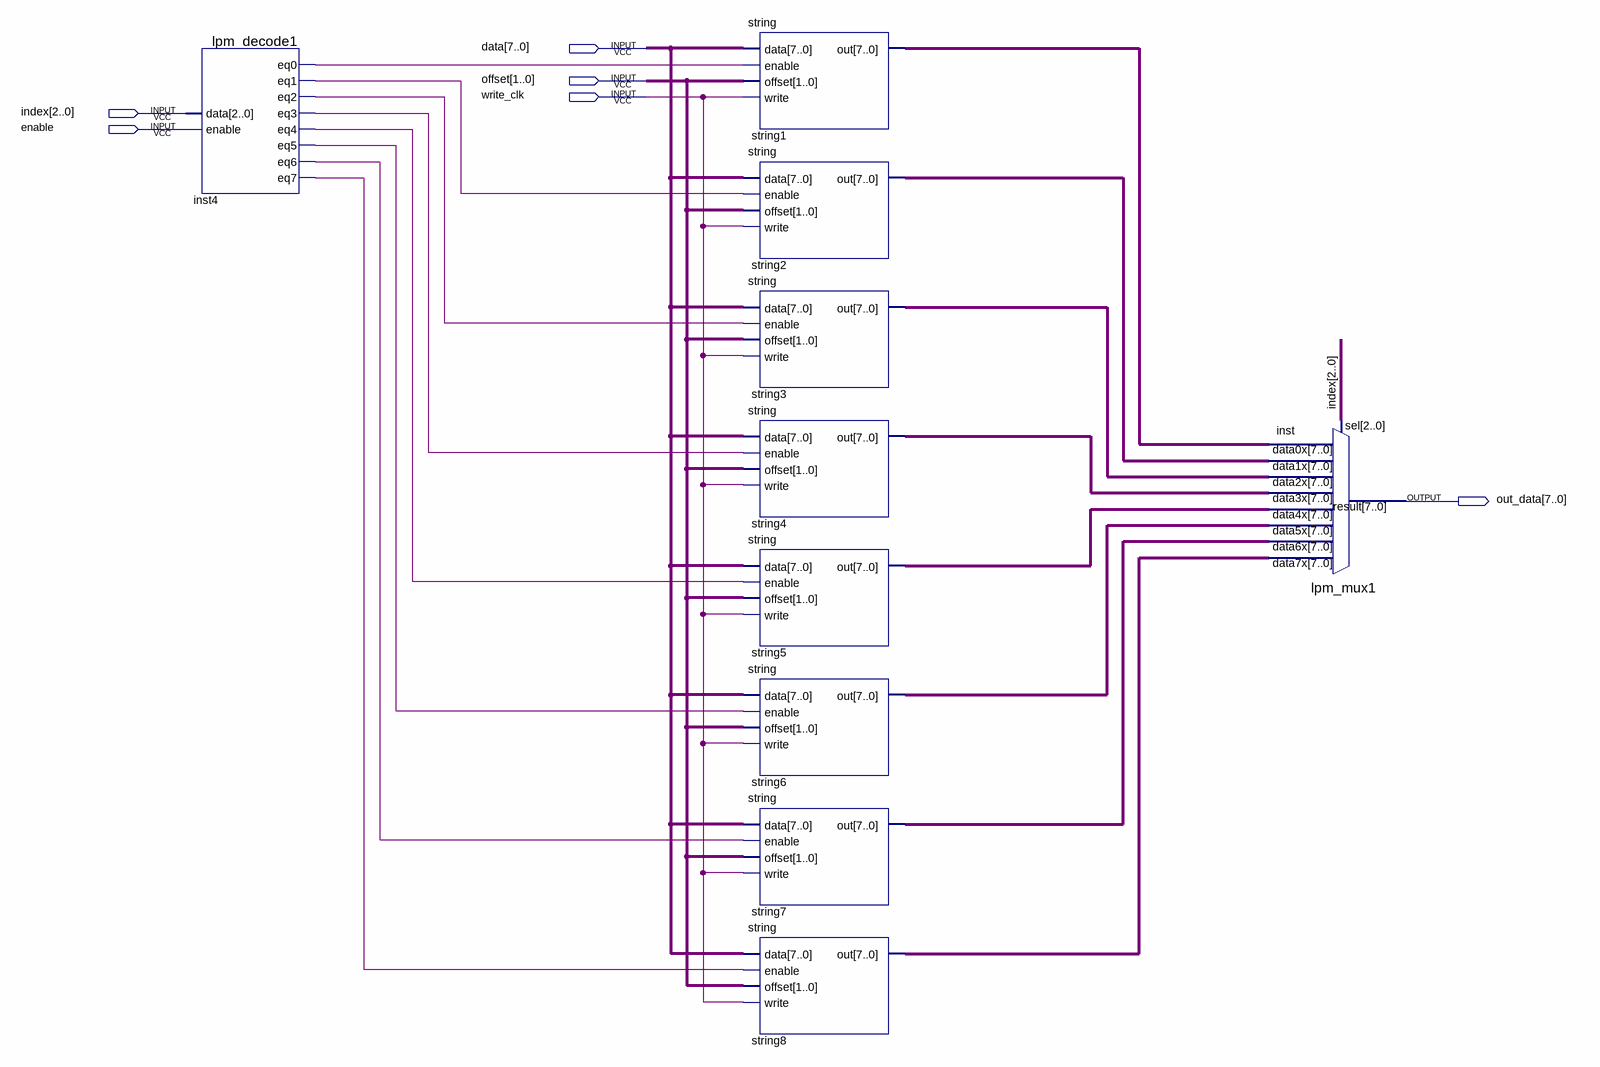
[diagram p0: schematic sheet]
// Quartus schematic strings.bdf as structural Verilog: 10 symbols, 6 pins
module strings (
  input  [7:0] data,
  input  [1:0] offset,
  input  write_clk,
  input  [2:0] index,
  input  enable,
  output [7:0] out_data
);

  wire inst4_eq0, inst4_eq1, inst4_eq2, inst4_eq3, inst4_eq4, inst4_eq5, inst4_eq6, inst4_eq7;
  wire [7:0] string1_out, string2_out, string3_out, string4_out, string5_out, string6_out, string7_out,
       string8_out;

  lpm_decode1 inst4 (
    .data(index), .enable(enable), .eq0(inst4_eq0), .eq1(inst4_eq1), .eq2(inst4_eq2), .eq3(inst4_eq3),
    .eq4(inst4_eq4), .eq5(inst4_eq5), .eq6(inst4_eq6), .eq7(inst4_eq7));
  \string  string1 (.data(data), .enable(inst4_eq0), .offset(offset), .write(write_clk), .out(string1_out));
  \string  string2 (.data(data), .enable(inst4_eq1), .offset(offset), .write(write_clk), .out(string2_out));
  \string  string3 (.data(data), .enable(inst4_eq2), .offset(offset), .write(write_clk), .out(string3_out));
  \string  string4 (.data(data), .enable(inst4_eq3), .offset(offset), .write(write_clk), .out(string4_out));
  \string  string5 (.data(data), .enable(inst4_eq4), .offset(offset), .write(write_clk), .out(string5_out));
  \string  string6 (.data(data), .enable(inst4_eq5), .offset(offset), .write(write_clk), .out(string6_out));
  \string  string7 (.data(data), .enable(inst4_eq6), .offset(offset), .write(write_clk), .out(string7_out));
  \string  string8 (.data(data), .enable(inst4_eq7), .offset(offset), .write(write_clk), .out(string8_out));
  lpm_mux1 inst (
    .data7x(string8_out), .data6x(string7_out), .data5x(string6_out), .data4x(string5_out),
    .data3x(string4_out), .data2x(string3_out), .data1x(string2_out), .data0x(string1_out), .sel(index),
    .result(out_data));
endmodule
